# Altium project Charger.PrjPCB
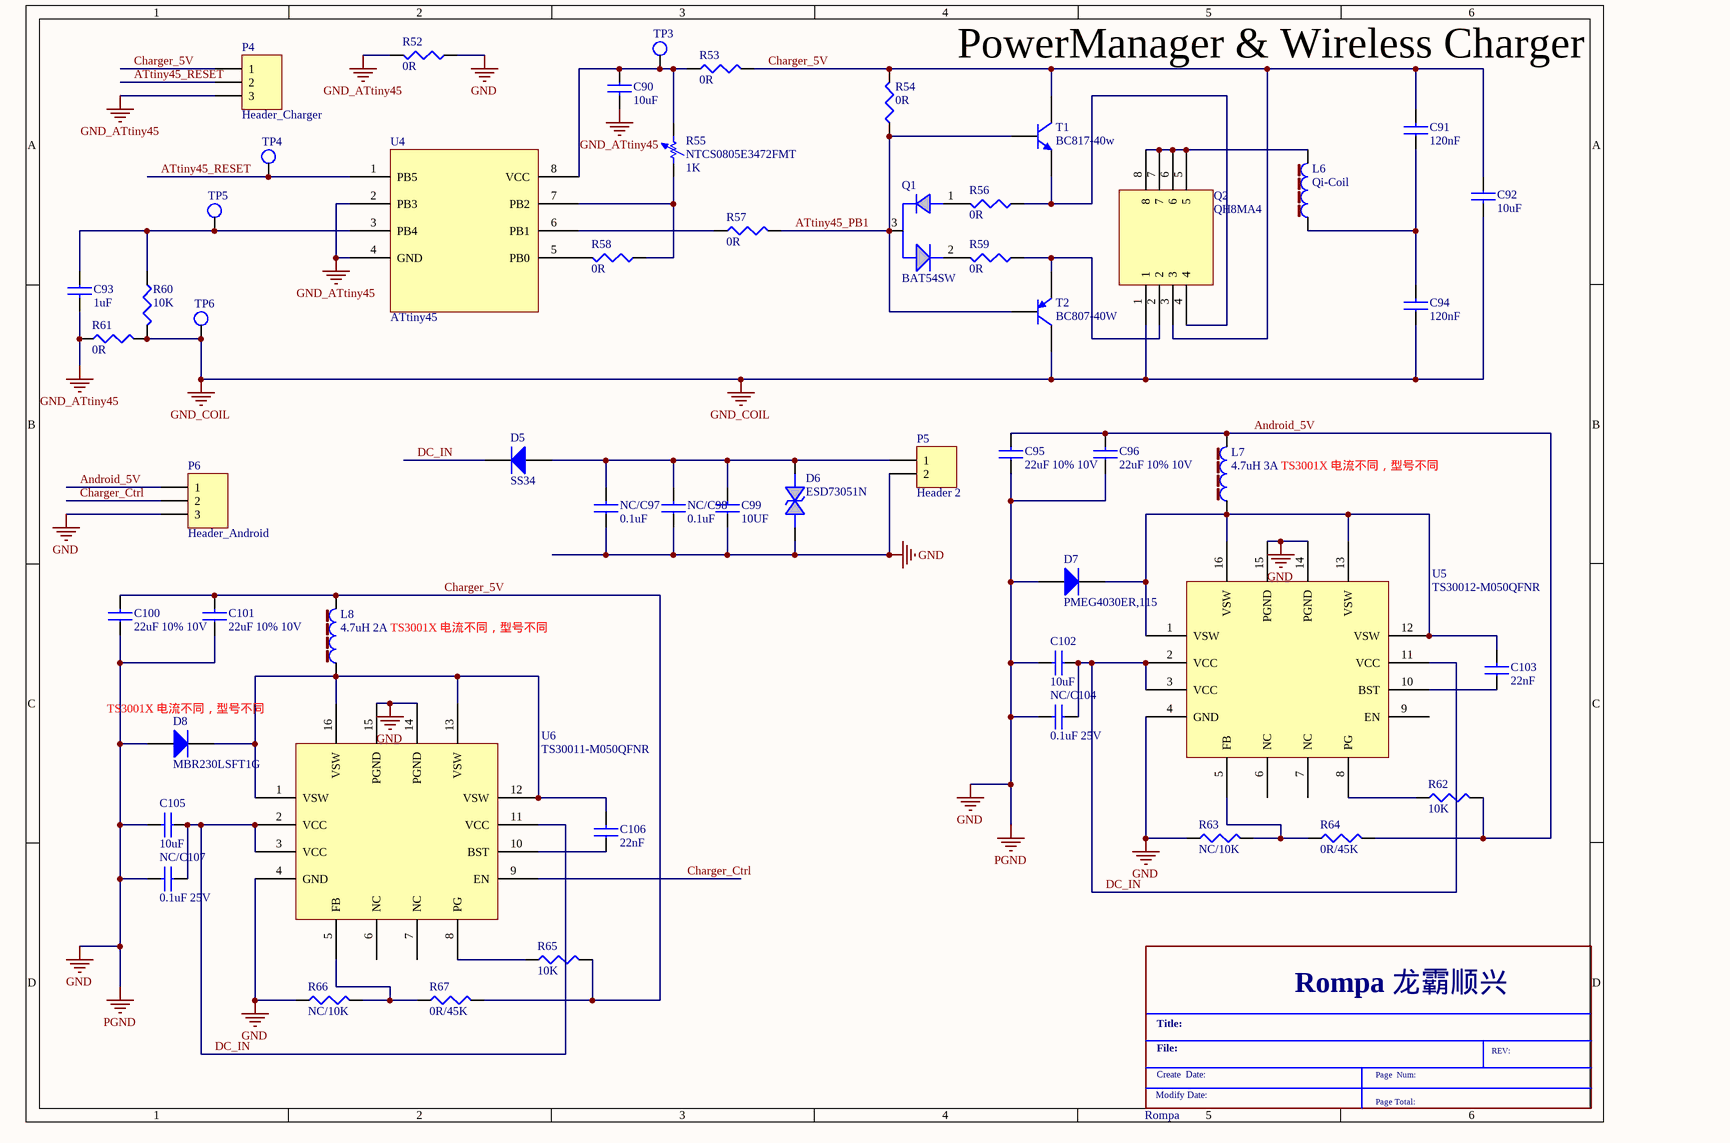
[diagram p0: Option_Charger.SchDoc]
1 sheet, 56 parts. Net scope: global (net labels, ports and power ports of the same name join across sheets).

## Sheet Option_Charger.SchDoc
size 297 x 209 mm

### Parts
*  Rompa  (graphical)
C90  10uF  [2012[0805]]
C91  120nF  [C1206]
C92  10uF  [C0805]
C93  1uF  [C0805]
C94  120nF  [C1206]
C95  22uF 10% 10V  [C0805]
C96  22uF 10% 10V  [C0805]
C99  10UF  [C1210]
C100  22uF 10% 10V  [C0805]
C101  22uF 10% 10V  [C0805]
C102  10uF  [C1206]
C103  22nF  [C0402]
C105  10uF  [C1206]
C106  22nF  [C0402]
D5  SS34
D6  ESD73051N
D7  PMEG4030ER,115
D8  MBR230LSFT1G
L6  Qi-Coil
L7  4.7uH 3A
L8  4.7uH 2A
NC/C97  0.1uF  [C0805]
NC/C98  0.1uF  [C0805]
NC/C104  0.1uF 25V  [C0402]
NC/C107  0.1uF 25V  [C0402]
P4  Header_Charger  [HDR1X3]
P5  Header 2  [HDR1X2]
P6  Header_Android  [HDR1X3]
Q1  BAT54SW
Q2  QH8MA4  [TSMT8]
R52  0R  [R0402]
R53  0R  [R0402]
R54  0R  [R0402]
R55  NTCS0805E3472FMT  value 1K  [2012[0805]]
R56  0R  [R0402]
R57  0R  [R0402]
R58  0R  [R0402]
R59  0R  [R0402]
R60  10K  [1608[0603]]
R61  0R  [R0402]
R62  10K  [R0402]
R63  NC/10K  [R0402]
R64  0R/45K  [R0402]
R65  10K  [R0402]
R66  NC/10K  [R0402]
R67  0R/45K  [R0402]
T1  BC817-40w
T2  BC807-40W
TP3  (no value)  [TEST]
TP4  (no value)  [TEST]
TP5  (no value)  [TEST]
TP6  (no value)  [TEST]
U4  ATtiny45  [8 pin SOIC_M]
U5  TS30012-M050QFNR  [16-QFN]
U6  TS30011-M050QFNR  [16-QFN]

### Nets
GND: C95.1 C96.1 C99.1 C100.1 C101.1 C102.2 C105.2 D6.1 D7.1(A) D8.1(A) NC/C97.1 NC/C98.1 NC/C104.2 NC/C107.2 P5.2 P6.3 R52.1 R63.1 R66.1 U5.4(GND) U5.14(PGND) U5.15(PGND) U6.4(GND) U6.14(PGND) U6.15(PGND)  [also labelled PGND]
GND_ATtiny45: C90.2 C93.2 P4.3 R52.2 R61.1 U4.2(PB3) U4.4(GND)
GND_COIL: C92.2 C94.1 Q2.1 R60.2 R61.2 T2.3(C) TP6.1
Android_5V: C95.2 C96.2 L7.2 P6.1 R62.2 R64.2
ATtiny45_PB1: Q1.3(K) R54.1 R57.2 T1.2(B) T2.2(B)
ATtiny45_RESET: P4.2 TP4.1 U4.1(PB5)
Charger_5V: C91.2 C92.1 C100.2 C101.2 L8.2 P4.1 Q2.3 R53.2 R54.2 R65.2 R67.2 T1.3(C)
Charger_Ctrl: P6.2 U6.9(EN)
DC_IN: C102.1 C105.1 D5.2(K) NC/C104.1 NC/C107.1 U5.2(VCC) U5.3(VCC) U5.11(VCC) U6.2(VCC) U6.3(VCC) U6.11(VCC)
NetC90_1: C90.1 R53.1 R55.2 TP3.1 U4.8(VCC)
NetC91_1: C91.1 C94.2 L6.1
NetC93_1: C93.1 R60.1 TP5.1 U4.3(PB4)
NetC99_2: C99.2 D5.1(A) D6.2 NC/C97.2 NC/C98.2 P5.1
NetC103_1: C103.1 U5.10(BST)
NetC103_2: C103.2 D7.2(K) L7.1 U5.1(VSW) U5.12(VSW) U5.13(VSW) U5.16(VSW)
NetC106_1: C106.1 U6.10(BST)
NetC106_2: C106.2 D8.2(K) L8.1 U6.1(VSW) U6.12(VSW) U6.13(VSW) U6.16(VSW)
NetL6_2: L6.2 Q2.5 Q2.6 Q2.7 Q2.8
NetQ1_1: Q1.1(A1) R56.2
NetQ1_2: Q1.2(A2) R59.2
NetQ2_2: Q2.2 R59.1 T2.1(E)
NetQ2_4: Q2.4 R56.1 T1.1(E)
NetR55_1: R55.1 R58.1 U4.7(PB2)
NetR57_1: R57.1 U4.6(PB1)
NetR58_2: R58.2 U4.5(PB0)
NetR62_1: R62.1 U5.8(PG)
NetR63_2: R63.2 R64.1 U5.5(FB)
NetR65_1: R65.1 U6.8(PG)
NetR66_2: R66.2 R67.1 U6.5(FB)

Not connected (* = marked no-connect by the designer): U5 6(NC) 7(NC) 9(EN); U6 6(NC) 7(NC)

### Notes on the sheet
- PowerManager & Wireless Charger
- TS3001X 电流不同，型号不同
- (near D8) TS3001X 电流不同，型号不同
- (in symbol Rompa) Rompa 龙霸顺兴; Title:; File:; REV:; Create  Date:; Page  Num:; Modify Date:; Page Total:

### Library data of the parts
C90 = CAP NP: C0805C106J8RACAUTO KEMET
C91 C94 = CAP NP: C1206C124J5RACTU KEMET  120nF, 50V, 5%, COG  CoiX7R (or better), 5%
C92 = CAP NP_Dup1: C0805C106J8RACAUTO KEMET 10U  CoiX7R (or better), 5%
C93 = CAP NP: C0805C105J3RACTU  KEMET
C95 C96 C100 C101 = CAP NP: C2012X5R1A226K125AB TDK
C99 = CAP NP: CAP CER 10UF 50V X7S 1210  C3225X7S1H106M250AB  TDK Corporation
C102 C105 = CAP NP: Capacitor  10uF 10% 35V TDK CGA5L3X5R1V106K160AB
C103 C106 = CAP NP: 15nF-200nF 10V TDK C1005X7R1C223K
D5 = Diode: Fairchild/ON Semiconductor     DO-214AB, SMC; Published: 8-Jun-2000; LatestRevisionDate: 17-Jul-2002; LatestRevisionNote: Re-released for DXP Platform.; PackageDocument: Sep-1996; PackageReference: SMC; Publisher: Altium Limited; Code_JEDEC: DO-214-AB
D6 = DIODE BI-DIR TRIG: FP=DFN1006-2L
D7 = Diode: 40V 3A  SOD-123 NXP Semiconductors; Published: 8-Jun-2000; LatestRevisionDate: 17-Jul-2002; LatestRevisionNote: Re-released for DXP Platform.; PackageDocument: Sep-1996; PackageReference: SMC; Publisher: Altium Limited; Code_JEDEC: DO-214-AB
D8 = Diode: 30V 2A  SOD-123FL On Semiconductor MBR230LSFT1G; Published: 8-Jun-2000; LatestRevisionDate: 17-Jul-2002; LatestRevisionNote: Re-released for DXP Platform.; PackageDocument: Sep-1996; PackageReference: SMC; Publisher: Altium Limited; Code_JEDEC: DO-214-AB
L6 = INDUCTOR_2
L7 = INDUCTOR_2: 4.7uH 3A TDK-----VLC5045T-4R7M   /  Wurth-----744774047
L8 = INDUCTOR_2: 4.7uH 2A     TDK---SLF7045T-4R7M2R0-PF  Wurth-----7447745047
NC/C97 NC/C98 = CAP NP: CGA3E2X7R1H104K080AA  TDK Corporation    0.1μF  ±10%  50V  X7R
NC/C104 NC/C107 = CAP NP
P4 P6 = Header 3: Header, 3-Pin; LatestRevisionDate: 17-Jul-2002; LatestRevisionNote: Re-released for DXP Platform.; Publisher: Altium Limited
P5 = Header 2: Header, 2-Pin; LatestRevisionDate: 17-Jul-2002; LatestRevisionNote: Re-released for DXP Platform.; Publisher: Altium Limited
Q1 = BAT54SW: SOT323
Q2 = QH8MA4: TSMT8
R52-R54 R56-R59 R61-R67 = RESISTOR
R55 = Res Adj1: 4K7 NTC 1%; Set Position: 0.5; Published: 8-Jun-2000; LatestRevisionDate: 17-Jul-2002; LatestRevisionNote: Re-released for DXP Platform.; PackageReference: AXIAL-0.7; Publisher: Altium Limited
R60 = RESISTOR: RC0603FR-0710KL Yageo
T1 = 2N3904: SOT323; Published: 8-Jun-2000; LatestRevisionDate: 15-Jan-2003; LatestRevisionNote: PCB Footprint 'BCY-W3/D4.7' replaced; DatasheetDocument: 1997; PackageDocument: Sep-1998; PackageReference: TO-92A; Publisher: Altium Limited; Code_JEDEC: TO-92A; ComponentLink1Description: Manufacturer Link; ComponentLink1URL: http://www.fairchildsemi.com/; ComponentLink2Description: Datasheet; ComponentLink2URL: http://www.fairchildsemi.com/ds/2N%2F2N3904.pdf
T2 = 2N3906: SOT323; Published: 8-Jun-2000; LatestRevisionDate: 15-Jan-2003; LatestRevisionNote: PCB Footprint 'BCY-W3/D4.7' replaced; DatasheetDocument: 1997; PackageDocument: Sep-1998; PackageReference: TO-92A; Publisher: Altium Limited; Code_JEDEC: TO-92A; ComponentLink1Description: Manufacturer Link; ComponentLink1URL: http://www.fairchildsemi.com/; ComponentLink2Description: Datasheet; ComponentLink2URL: http://www.fairchildsemi.com/ds/2N%2F2N3906.pdf
TP3-TP6 = TESTPOINT1_0
U6 = TS30012-M050QFNR